# Altium project cameraTri-v1_1.PrjPCB
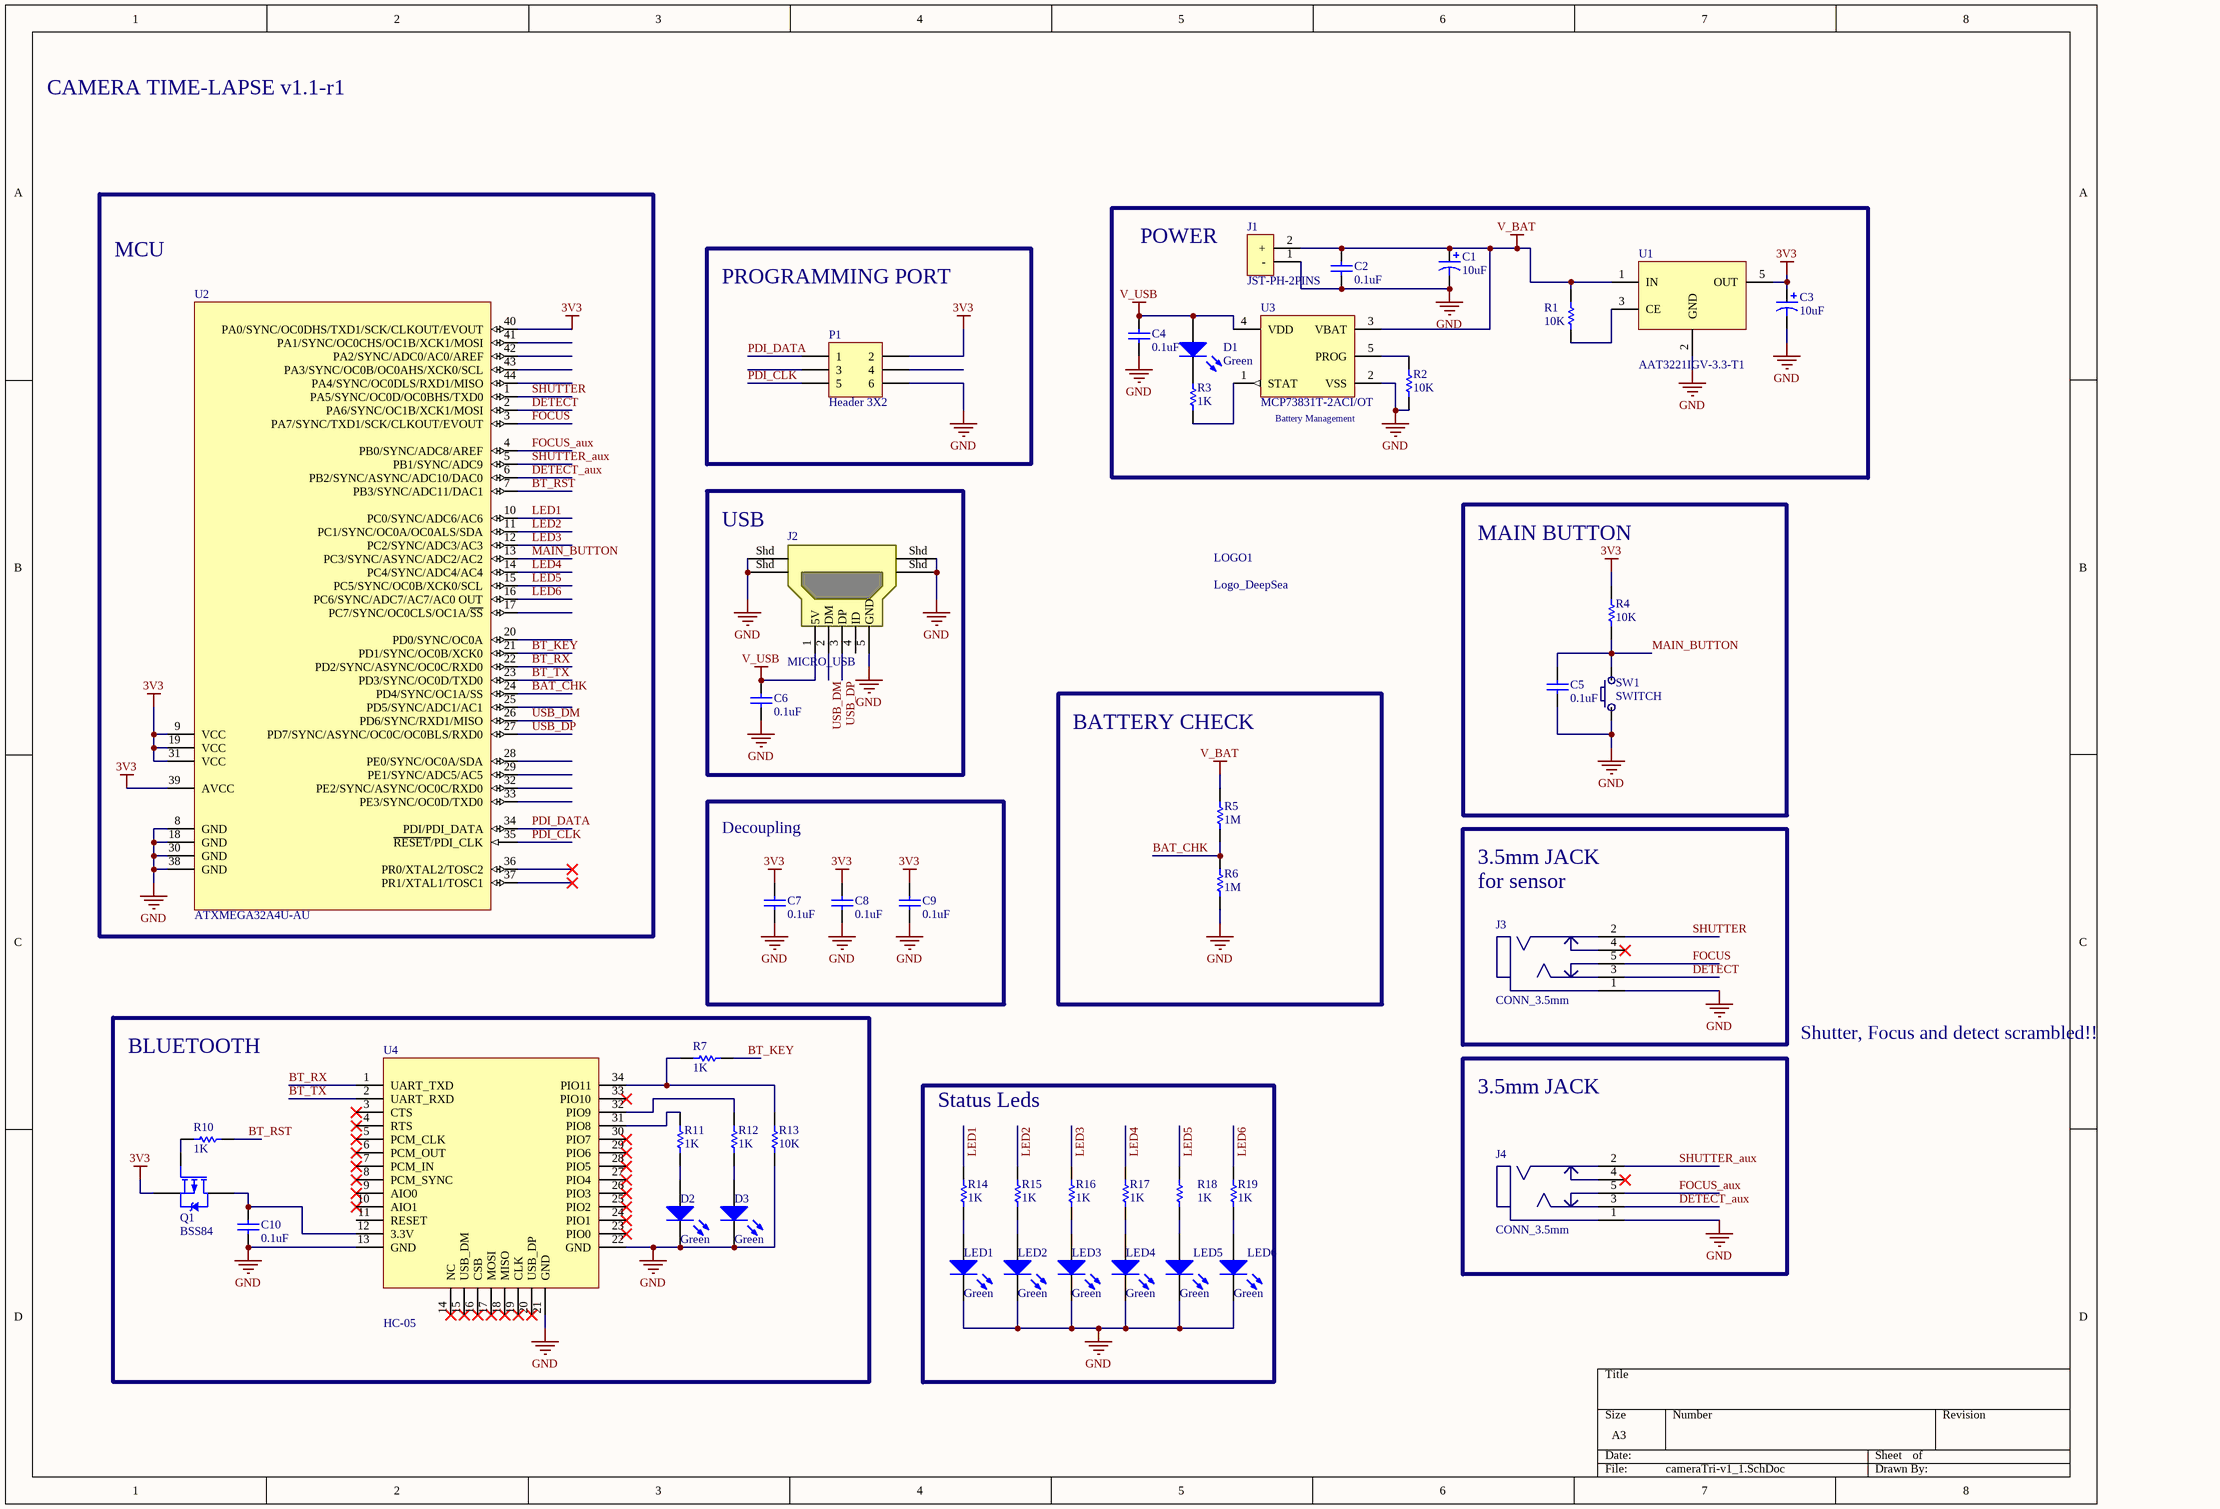
[diagram p0: cameraTri-v1_1.SchDoc]
1 sheet, 48 parts. Net scope: global (net labels, ports and power ports of the same name join across sheets).
Board file: cameraTri-v1_1.PcbDoc

## Sheet cameraTri-v1_1.SchDoc
size A3

### Parts
C1  10uF  [C_TANT_A_3216_N]
C2  0.1uF  [C0603_N]
C3  10uF  [C_TANT_A_3216_N]
C4  0.1uF  [C0603_N]
C5  0.1uF  [C0603_N]
C6  0.1uF  [C0603_N]
C7  0.1uF  [C0603_N]
C8  0.1uF  [C0603_N]
C9  0.1uF  [C0603_N]
C10  0.1uF  [C0603_N]
D1  Green  [R0603_N]
D2  Green  [R0603_N]
D3  Green  [R0603_N]
J1  JST-PH-2PINS  [JST-PH-2]
J2  MICRO_USB  [USB_MICRO_SMD]
J3  CONN_3.5mm  [JACK_3.5MM]
J4  CONN_3.5mm  [JACK_3.5MM]
LED1  Green  [R0603_N]
LED2  Green  [R0603_N]
LED3  Green  [R0603_N]
LED4  Green  [R0603_N]
LED5  Green  [R0603_N]
LED6  Green  [R0603_N]
LOGO1  Logo_DeepSea  [DeepSea_logo1]
P1  Header 3X2  [HDR2X3]
Q1  BSS84  [SOT-23_N]
R1  10K  [R0603_N]
R2  10K  [R0603_N]
R3  1K  [R0603_N]
R4  10K  [R0603_N]
R5  1M  [R0603_N]
R6  1M  [R0603_N]
R7  1K  [R0603_N]
R10  1K  [R0603_N]
R11  1K  [R0603_N]
R12  1K  [R0603_N]
R13  10K  [R0603_N]
R14  1K  [R0603_N]
R15  1K  [R0603_N]
R16  1K  [R0603_N]
R17  1K  [R0603_N]
R18  1K  [R0603_N]
R19  1K  [R0603_N]
SW1  SWITCH  [swich_foot]
U1  AAT3221IGV-3.3-T1  [SOT-23-OT5_N]
U2  ATXMEGA32A4U-AU  [44A_N]
U3  MCP73831T-2ACI/OT  [SOT-23-OT5_N]
U4  HC-05  [HC-05]

### Nets
3V3: C3.1 C7.2 C8.2 C9.2 P1.2 Q1.3(S) R4.2 U1.5(OUT) U2.9(VCC) U2.19(VCC) U2.31(VCC) U2.39(AVCC) U2.40(PA0/SYNC/OC0DHS/TXD1/SCK/CLKOUT/EVOUT)
GND: C1.2 C2.1 C3.2 C4.1 C5.2 C6.1 C7.1 C8.1 C9.1 C10.1 D2.2(K) D3.2(K) J1.1(-) J2.5(GND) J2.Shd J3.1 J4.1 LED1.2(K) LED2.2(K) LED3.2(K) LED4.2(K) LED5.2(K) LED6.2(K) P1.6 R2.1 R6.2 R13.2 SW1.1 U1.2(GND) U2.8(GND) U2.18(GND) U2.30(GND) U2.38(GND) U3.2(VSS) U4.13(GND) U4.21(GND) U4.22(GND)
V_BAT: C1.1 C2.2 J1.2(+) R1.2 R5.1 U1.1(IN) U3.3(VBAT)
V_USB: C4.2 C6.2 D1.1(A) J2.1(5V) U3.4(VDD)
BAT_CHK: R5.2 R6.1 U2.24(PD4/SYNC/OC1A/SS)
BT_KEY: R7.1 U2.21(PD1/SYNC/OC0B/XCK0)
BT_RST: R10.2 U2.7(PB3/SYNC/ADC11/DAC1)
BT_RX: U2.22(PD2/SYNC/ASYNC/OC0C/RXD0) U4.1(UART_TXD)
BT_TX: U2.23(PD3/SYNC/OC0D/TXD0) U4.2(UART_RXD)
DETECT: J3.3 U2.2(PA6/SYNC/OC1B/XCK1/MOSI)
DETECT_aux: J4.3 U2.6(PB2/SYNC/ASYNC/ADC10/DAC0)
FOCUS: J3.5 U2.3(PA7/SYNC/TXD1/SCK/CLKOUT/EVOUT)
FOCUS_aux: J4.5 U2.4(PB0/SYNC/ADC8/AREF)
LED1: R14.1 U2.10(PC0/SYNC/ADC6/AC6)
LED2: R15.1 U2.11(PC1/SYNC/OC0A/OC0ALS/SDA)
LED3: R16.1 U2.12(PC2/SYNC/ADC3/AC3)
LED4: R17.1 U2.14(PC4/SYNC/ADC4/AC4)
LED5: R18.1 U2.15(PC5/SYNC/OC0B/XCK0/SCL)
LED6: R19.1 U2.16(PC6/SYNC/ADC7/AC7/AC0_OUT)
MAIN_BUTTON: C5.1 R4.1 SW1.2 U2.13(PC3/SYNC/ASYNC/ADC2/AC2)
PDI_CLK: P1.5 U2.35(~{RESET}/PDI_CLK)
PDI_DATA: P1.1 U2.34(PDI/PDI_DATA)
SHUTTER: J3.2 U2.1(PA5/SYNC/OC0D/OC0BHS/TXD0)
SHUTTER_aux: J4.2 U2.5(PB1/SYNC/ADC9)
USB_DM: J2.2(DM) U2.26(PD6/SYNC/RXD1/MISO)
USB_DP: J2.3(DP) U2.27(PD7/SYNC/ASYNC/OC0C/OC0BLS/RXD0)
NetC10_2: C10.2 Q1.2(D) U4.12(3.3V)
NetD1_2: D1.2(K) R3.1
NetD2_1: D2.1(A) R11.2
NetD3_1: D3.1(A) R12.2
NetLED1_1: LED1.1(A) R14.2
NetLED2_1: LED2.1(A) R15.2
NetLED3_1: LED3.1(A) R16.2
NetLED4_1: LED4.1(A) R17.2
NetLED5_1: LED5.1(A) R18.2
NetLED6_1: LED6.1(A) R19.2
NetQ1_1: Q1.1(G) R10.1
NetR1_1: R1.1 U1.3(CE)
NetR2_2: R2.2 U3.5(PROG)
NetR3_2: R3.2 U3.1(STAT)
NetR7_2: R7.2 R13.1 U4.34(PIO11)
NetR11_1: R11.1 U4.31(PIO8)
NetR12_1: R12.1 U4.32(PIO9)

Not connected (* = marked no-connect by the designer): J2 4(ID); J3 4*; J4 4*; P1 3 4; U2 17(PC7/SYNC/OC0CLS/OC1A/~{SS}) 20(PD0/SYNC/OC0A) 25(PD5/SYNC/ADC1/AC1) 28(PE0/SYNC/OC0A/SDA) 29(PE1/SYNC/ADC5/AC5) 32(PE2/SYNC/ASYNC/OC0C/RXD0) 33(PE3/SYNC/OC0D/TXD0) 36(PR0/XTAL2/TOSC2)* 37(PR1/XTAL1/TOSC1)* 41(PA1/SYNC/OC0CHS/OC1B/XCK1/MOSI) 42(PA2/SYNC/ADC0/AC0/AREF) 43(PA3/SYNC/OC0B/OC0AHS/XCK0/SCL) 44(PA4/SYNC/OC0DLS/RXD1/MISO); U4 3(CTS)* 4(RTS)* 5(PCM_CLK)* 6(PCM_OUT)* 7(PCM_IN)* 8(PCM_SYNC)* 9(AIO0)* 10(AIO1)* 11(RESET) 14(NC)* 15(USB_DM)* 16(CSB)* 17(MOSI)* 18(MISO)* 19(CLK)* 20(USB_DP)* 23(PIO0)* 24(PIO1)* 25(PIO2)* 26(PIO3)* 27(PIO4)* 28(PIO5)* 29(PIO6)* 30(PIO7)* 33(PIO10)*

### Notes on the sheet
- CAMERA TIME-LAPSE v1.1-r1
- (near J1) POWER
- MCU
- PROGRAMMING PORT
- Battery Management
- (near J2) USB
- MAIN BUTTON
- BATTERY CHECK
- Decoupling
- (near J3) 3.5mm JACK
  for sensor
- BLUETOOTH
- Shutter, Focus and detect scrambled!!
- Status Leds
- 3.5mm JACK

### Library data of the parts
C1 C3 = CP_SMD: Value: 10uF
C2 C4-C10 = C_SMD: Value: 0.1uF
D1-D3 LED1-LED6 = LED_SMD: Color: Green
J1 = JST-PH-2PINS: CONN HEADER PH SIDE 2POS 2MM SMD; Manufacturer: JST Sales America Inc; Manufacturer Part Number: S2B-PH-SM4-TB(LF)(SN); Connector Type: Header, Shrouded; Number of Positions: 2; Number of Positions Loaded: All; Pitch: 0.079" (2.00mm); Supplier 1: Digi-Key; RoHS: RoHS Compliant; Category: Connectors, Interconnects; Stock 1: 51442; Pricing 1: 1=0.56, 10=0.521, 50=0.4168, 100=0.3994, 250=0.36472, 500=0.34734 (USD); Packaging: Cut Tape (CT); Contact Type: Male Pin; Number of Rows: 1; Row Spacing: -; Contact Mating Length: -; Mounting Type: Surface Mount, Right Angle; Termination: Solder; Fastening Type: -; Features: Solder Retention; Contact Finish: Tin; Contact Finish Thickness: -; Color: Natural; ComponentLink1URL: http://www.jst-mfg.com/product/pdf/eng/ePH.pdf; ComponentLink1Description: http://www.jst-mfg.com/product/pdf/eng/ePH.pdf; Supplier Part Number 1: 455-1749-1-ND
J2 = MICRO_USB: CONN USB MICRO B RECPT SMT R/A; Manufacturer: FCI; Manufacturer Part Number: 10118194-0001LF; Connector Type: USB - micro B; Number of Contacts: 5; Gender: Receptacle; Specifications: USB 2.0; Supplier 1: Digi-Key; RoHS: RoHS Compliant; Category: Connectors, Interconnects; Stock 1: 9139; Pricing 1: 1=0.46, 10=0.433, 25=0.3712, 50=0.3156, 100=0.3032, 250=0.27224, 500=0.25988 (USD); Packaging: Cut Tape (CT); Mounting Type: Surface Mount, Right Angle, Horizontal; Features: Shielded, Solder Retention; Ingress Protection: -; ComponentLink1URL: http://portal.fciconnect.com/Comergent//fci/drawing/10118194.pdf; ComponentLink1Description: http://portal.fciconnect.com/Comergent//fci/drawing/10118194.pdf; Supplier Part Number 1: 609-4618-1-ND
J3 J4 = CONN_3.5mm: CONN JACK STEREO 3.5MM SMD; Manufacturer: Switchcraft Inc.; Manufacturer Part Number: 35RASMT4BHNTRX; Connector Type: Phone Jack; Gender: Female; Plug/Mating Plug Diameter: 3.50mm (0.141", 1/8", Mini Plug) - Headphone; Number of Positions/Contacts: 3 Conductors, 5 Contacts; Internal Switch(s): Two Switches; Shielding: Unshielded; Color - Contact: Gold; Voltage - Rated: 250VAC; Current Rating: 3A; Supplier 1: Digi-Key; RoHS: RoHS Compliant; Category: Connectors, Interconnects; Stock 1: 3537; Pricing 1: 1=0.65 (USD); Signal Lines: Stereo; Mounting Type: Surface Mount, Right Angle; Termination: Solder; Features: -; Contact Material: Copper Alloy; Contact Material - Plating: Silver; Housing Material: Thermoplastic; Housing Color: Black; Operating Temperature: -25°C ~ 85°C; Packaging: Digi-Reel®; ComponentLink1URL: http://www.switchcraft.com/Drawings/35rasmt4bhntrx_cd.pdf; ComponentLink1Description: http://www.switchcraft.com/Drawings/35rasmt4bhntrx_cd.pdf; Supplier Part Number 1: SC1488-6-ND
P1 = Header 3X2: Header, 3-Pin, Dual row; LatestRevisionDate: 17-Jul-2002; LatestRevisionNote: Re-released for DXP Platform.; Publisher: Altium Limited
Q1 = BSS84: MOSFET P-CH 50V 130MA SOT-23; Manufacturer: Fairchild Semiconductor; FET Type: MOSFET P-Channel, Metal Oxide; FET Feature: Logic Level Gate; Current - Continuous Drain (Id) @ 25°C: 130mA (Ta); Rds On (Max) @ Id, Vgs: 10 Ohm @ 100mA, 5V; Vgs(th) (Max) @ Id: 2V @ 1mA; Gate Charge (Qg) @ Vgs: 1.3nC @ 5V; Input Capacitance (Ciss) @ Vds: 73pF @ 25V; Power - Max: 360mW; Supplier 1: Digi-Key; Manufacturer Part Number: BSS84; RoHS: RoHS Compliant; Category: Discrete Semiconductor Products; Stock 1: 131262; Pricing 1: 1=0.22, 10=0.198, 25=0.1428, 100=0.111, 250=0.06976, 500=0.05944, 1000=0.0405 (USD); Packaging: Cut Tape (CT); Drain to Source Voltage (Vdss): 50V; Mounting Type: Surface Mount; Package / Case: TO-236-3, SC-59, SOT-23-3; Supplier Device Package: SOT-23; ComponentLink1URL: http://www.fairchildsemi.com/ds/BS/BSS84.pdf; ComponentLink1Description: http://www.fairchildsemi.com/ds/BS/BSS84.pdf; Supplier Part Number 1: BSS84CT-ND
R1-R7 R10-R19 = R_SMD
  R1 R2 R4 R13: Value: 10K
  R3 R7 R10-R12 R14-R19: Value: 1K
  R5 R6: Value: 1M
SW1 = SWITCH: SWITCH TACTILE SPST-NO 0.05A 12V; Manufacturer: TE Connectivity; Manufacturer Part Number: FSM4JSMATR; Switch Function: Off-Mom; Contact Rating @ Voltage: 0.05A @ 12VDC; Actuator Type: Standard; Actuator Height off PCB, from Pins: 5.00mm; Actuator Orientation: Top Actuated; Outline: 6.00mm x 6.00mm; Illumination: Non-Illuminated; Operating Force: 160gf; Actuator Material: Polyphenylene Sulfide (PPS); Switch Travel: 0.25mm; Mechanical Life: 100,000 Cycles; Supplier 1: Digi-Key; RoHS: RoHS Compliant; Category: Switches; Stock 1: 33712; Pricing 1: 1=0.23, 10=0.223, 25=0.2136, 50=0.2038, 100=0.1843, 250=0.1698, 500=0.15524 (USD); Packaging: Cut Tape (CT); Circuit: SPST-NO; Mounting Type: Surface Mount; Termination Style: Gull Wing; Illumination Voltage (Nominal): -; Illumination Type, Color: -; Ingress Protection: -; Features: -; Operating Temperature: -35°C ~ 85°C; ComponentLink1URL: http://www.te.com/commerce/DocumentDelivery/DDEController?Action=srchrtrv&DocNm=2-1437565-7&DocType=Customer+Drawing&DocLang=English; ComponentLink1Description: http://www.te.com/commerce/DocumentDelivery/DDEController?Action=srchrtrv&DocNm=2-1437565-7&DocType=Customer+Drawing&DocLang=English; Supplier Part Number 1: 450-1759-1-ND
U1 = AAT3221IGV-3.3-T1: IC REG LDO 3.3V 0.15A SOT23-5; Manufacturer: Skyworks Solutions Inc; Regulator Topology: Positive Fixed; Current - Output: 150mA; Voltage - Dropout (Typical): 0.18V @ 100mA; Number of Regulators: 1; Voltage - Input: Up to 5.5V; Supplier 1: Digi-Key; Manufacturer Part Number: AAT3221IGV-3.3-T1; RoHS: RoHS Compliant; Category: Integrated Circuits (ICs); Stock 1: 55137; Pricing 1: 1=0.17, 100=0.15 (USD); Packaging: Cut Tape (CT); Voltage - Output: 3.3V; Current - Limit (Min): -; Operating Temperature: -40°C ~ 85°C; Mounting Type: Surface Mount; Package / Case: SC-74A, SOT-753; Supplier Device Package: SOT-23-5; ComponentLink1URL: http://www.skyworksinc.com/uploads/documents/AAT3221_AAT3222_202251B.pdf; ComponentLink1Description: http://www.skyworksinc.com/uploads/documents/AAT3221_AAT3222_202251B.pdf; Supplier Part Number 1: 863-1491-1-ND
U2 = ATXMEGA32A4U-AU: IC MCU 8BIT 32KB FLASH 44TQFP; Manufacturer: Atmel; Core Processor: AVR; Core Size: 8/16-Bit; Speed: 32MHz; Connectivity: I²C, IrDA, SPI, UART/USART, USB; Peripherals: Brown-out Detect/Reset, DMA, POR, PWM, WDT; Number of I /O: 34; Program Memory Size: 32KB (16K x 16); EEPROM Size: 2K x 8; RAM Size: 4K x 8; Voltage - Supply (Vcc/Vdd): 1.6 V ~ 3.6 V; Data Converters: A/D 12x12b, D/A 2x12b; Oscillator Type: Internal; Supplier 1: Digi-Key; RoHS: RoHS Compliant; Category: Integrated Circuits (ICs); Stock 1: 2077; Pricing 1: 1=3.43, 25=2.1548, 100=1.9152 (USD); Packaging: Tray; Program Memory Type: FLASH; Operating Temperature: -40°C ~ 85°C; Package / Case: 44-TQFP; ComponentLink1URL: http://www.atmel.com/Images/Atmel-8387-8-and16-bit-AVR-Microcontroller-XMEGA-A4U_Datasheet.pdf; ComponentLink1Description: http://www.atmel.com/Images/Atmel-8387-8-and16-bit-AVR-Microcontroller-XMEGA-A4U_Datasheet.pdf; Supplier Part Number 1: ATXMEGA32A4U-AU-ND; Manufacturer Part Number: ATXMEGA32A4U-AU
U3 = MCP73831T-2ACI/OT: IC CONTROLLR LI-ION 4.2V SOT23-5; Manufacturer: Microchip Technology; Function: Charge Management; Battery Chemistry: Li-Ion, Li-Pol; Voltage - Supply: 3.75 V ~ 6 V; Supplier 1: Digi-Key; RoHS: RoHS Compliant; Category: Integrated Circuits (ICs); Stock 1: 15473; Pricing 1: 1=0.67, 10=0.56, 25=0.47, 100=0.42 (USD); Packaging: Cut Tape (CT); Operating Temperature: -40°C ~ 85°C; Mounting Type: Surface Mount; Package / Case: SC-74A, SOT-753; Supplier Device Package: SOT-23-5; ComponentLink1URL: http://www.microchip.com/mymicrochip/filehandler.aspx?ddocname=en025112; ComponentLink1Description: http://www.microchip.com/mymicrochip/filehandler.aspx?ddocname=en025112; Supplier Part Number 1: MCP73831T-2ACI/OTCT-ND; Manufacturer Part Number: MCP73831T-2ACI/OT
U4 = HC-05: Bluetooth RS232 module